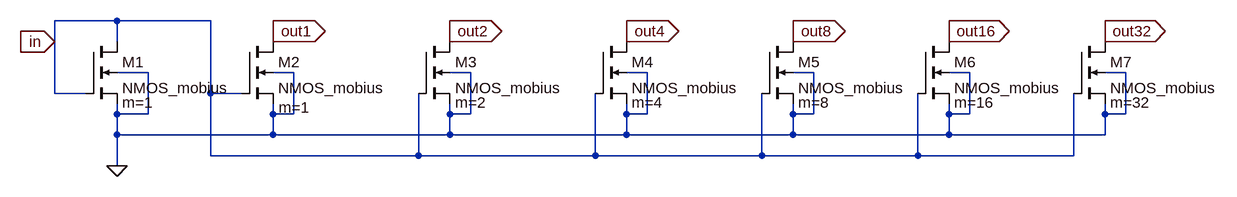
[diagram p0: schematic nMOS_currentMirror_array.asc]
nMOS_currentMirror_array.asc, the LTspice schematic file:
Version 4
SHEET 1 1796 680
WIRE 112 64 16 64
WIRE 256 64 112 64
WIRE 352 80 352 64
WIRE 624 80 624 64
WIRE 896 80 896 64
WIRE 1152 80 1152 64
WIRE 1392 80 1392 64
WIRE 1632 80 1632 64
WIRE 16 96 16 64
WIRE 112 96 112 64
WIRE 352 96 352 80
WIRE 624 96 624 80
WIRE 896 96 896 80
WIRE 1152 96 1152 80
WIRE 1392 96 1392 80
WIRE 1632 96 1632 80
WIRE 160 144 112 144
WIRE 384 144 352 144
WIRE 656 144 624 144
WIRE 928 144 896 144
WIRE 1184 144 1152 144
WIRE 1424 144 1392 144
WIRE 1664 144 1632 144
WIRE 16 176 16 96
WIRE 64 176 16 176
WIRE 256 176 256 64
WIRE 304 176 256 176
WIRE 112 208 112 192
WIRE 160 208 160 144
WIRE 160 208 112 208
WIRE 352 208 352 192
WIRE 384 208 384 144
WIRE 384 208 352 208
WIRE 624 208 624 192
WIRE 656 208 656 144
WIRE 656 208 624 208
WIRE 896 208 896 192
WIRE 928 208 928 144
WIRE 928 208 896 208
WIRE 1152 208 1152 192
WIRE 1184 208 1184 144
WIRE 1184 208 1152 208
WIRE 1392 208 1392 192
WIRE 1424 208 1424 144
WIRE 1424 208 1392 208
WIRE 1632 208 1632 192
WIRE 1664 208 1664 144
WIRE 1664 208 1632 208
WIRE 112 240 112 208
WIRE 352 240 352 208
WIRE 352 240 112 240
WIRE 624 240 624 208
WIRE 624 240 352 240
WIRE 896 240 896 208
WIRE 896 240 624 240
WIRE 1152 240 1152 208
WIRE 1152 240 896 240
WIRE 1392 240 1392 208
WIRE 1392 240 1152 240
WIRE 1632 240 1632 208
WIRE 1632 240 1392 240
WIRE 256 272 256 176
WIRE 576 272 576 176
WIRE 576 272 256 272
WIRE 848 272 848 176
WIRE 848 272 576 272
WIRE 1104 272 1104 176
WIRE 1104 272 848 272
WIRE 1344 272 1344 176
WIRE 1344 272 1104 272
WIRE 1584 272 1584 176
WIRE 1584 272 1344 272
WIRE 112 288 112 240
FLAG 352 80 out1
IOPIN 352 80 Out
FLAG 16 96 in
IOPIN 16 96 In
FLAG 112 288 0
FLAG 624 80 out2
IOPIN 624 80 Out
FLAG 896 80 out4
IOPIN 896 80 Out
FLAG 1152 80 out8
IOPIN 1152 80 Out
FLAG 1392 80 out16
IOPIN 1392 80 Out
FLAG 1632 80 out32
IOPIN 1632 80 Out
SYMBOL nmos4 64 96 R0
WINDOW 123 56 94 Left 2
SYMATTR Value2 m=1
SYMATTR InstName M1
SYMATTR Value NMOS_mobius
SYMATTR Prefix X
SYMBOL nmos4 304 96 R0
WINDOW 123 57 102 Left 2
SYMATTR Value2 m=1
SYMATTR InstName M2
SYMATTR Value NMOS_mobius
SYMATTR Prefix X
SYMBOL nmos4 576 96 R0
WINDOW 123 56 94 Left 2
SYMATTR Value2 m=2
SYMATTR InstName M3
SYMATTR Value NMOS_mobius
SYMATTR Prefix X
SYMBOL nmos4 848 96 R0
WINDOW 123 56 94 Left 2
SYMATTR Value2 m=4
SYMATTR InstName M4
SYMATTR Value NMOS_mobius
SYMATTR Prefix X
SYMBOL nmos4 1104 96 R0
WINDOW 123 56 94 Left 2
SYMATTR Value2 m=8
SYMATTR InstName M5
SYMATTR Value NMOS_mobius
SYMATTR Prefix X
SYMBOL nmos4 1344 96 R0
WINDOW 123 56 94 Left 2
SYMATTR Value2 m=16
SYMATTR InstName M6
SYMATTR Value NMOS_mobius
SYMATTR Prefix X
SYMBOL nmos4 1584 96 R0
WINDOW 123 56 94 Left 2
SYMATTR Value2 m=32
SYMATTR InstName M7
SYMATTR Value NMOS_mobius
SYMATTR Prefix X

The netlist it stands for:
* nMOS_currentMirror_array.asc
XM1 in in 0 0 NMOS_mobius m=1  ; pins D G S B
XM2 out1 in 0 0 NMOS_mobius m=1  ; pins D G S B
XM3 out2 in 0 0 NMOS_mobius m=2  ; pins D G S B
XM4 out4 in 0 0 NMOS_mobius m=4  ; pins D G S B
XM5 out8 in 0 0 NMOS_mobius m=8  ; pins D G S B
XM6 out16 in 0 0 NMOS_mobius m=16  ; pins D G S B
XM7 out32 in 0 0 NMOS_mobius m=32  ; pins D G S B
.backanno
.end